# Altium schematic sheet Error_Generator.SchDoc
size A; SheetNumber: 2; SheetTotal: 6
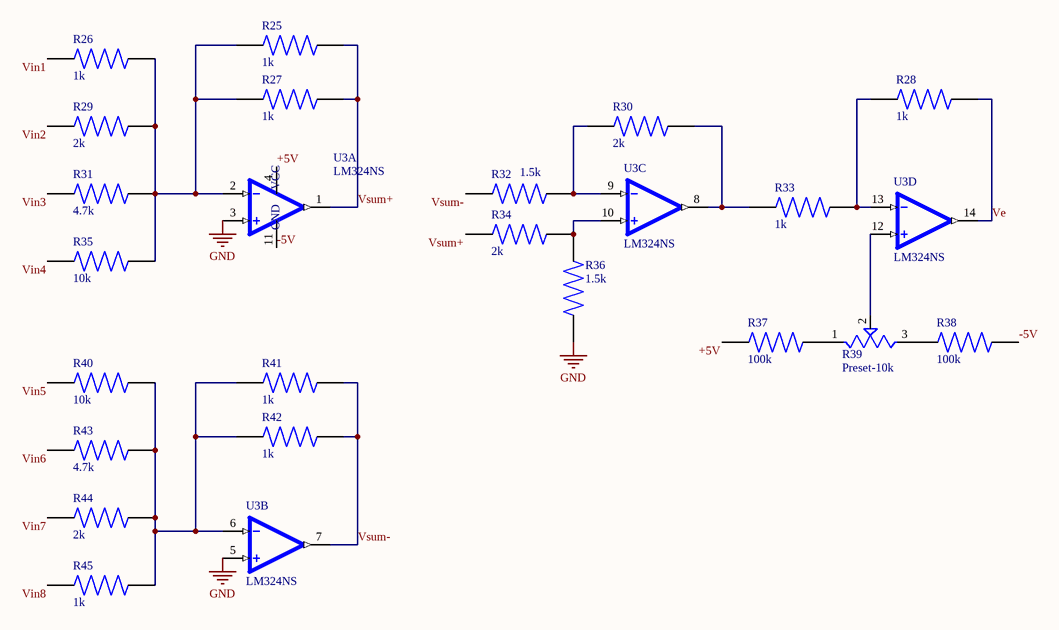
[diagram p0: Error_Generator.SchDoc]

## Parts
R25  1k  [RESC2012X60N]
R26  1k  [RESC2012X60N]
R27  1k  [RESC2012X60N]
R28  1k  [RESC2012X60N]
R29  2k  [RESC2012X60N]
R30  2k  [RESC2012X60N]
R31  4.7k  [RESC2012X60N]
R32  1.5k  [RESC2012X60N]
R33  1k  [RESC2012X60N]
R34  2k  [RESC2012X60N]
R35  10k  [RESC2012X60N]
R36  1.5k  [RESC2012X60N]
R37  100k  [RESC2012X60N]
R38  100k  [RESC2012X60N]
R39  Preset-10k  [TRIM_3306F-1-103]
R40  10k  [RESC2012X60N]
R41  1k  [RESC2012X60N]
R42  1k  [RESC2012X60N]
R43  4.7k  [RESC2012X60N]
R44  2k  [RESC2012X60N]
R45  1k  [RESC2012X60N]
U3  LM324NS  [SOIC127P780X200-14N]  (parts A,B,C,D of 4)

## Nets
GND: R36.1 U3.3(1IN+) U3.5(2IN+)
+5V: R37.1 U3.4(VCC)
-5V: R38.2 U3.11(GND)
Ve: R28.2 U3.14(4OUT)
Vin1: R26.1
Vin2: R29.1
Vin3: R31.1
Vin4: R35.1
Vin5: R40.1
Vin6: R43.1
Vin7: R44.1
Vin8: R45.1
Vsum+: R25.2 R27.2 R34.1 U3.1(1OUT)
Vsum-: R32.1 R41.2 R42.2 U3.7(2OUT)
NetR25_1: R25.1 R26.2 R27.1 R29.2 R31.2 R35.2 U3.2(1IN-)
NetR28_1: R28.1 R33.2 U3.13(4IN-)
NetR30_1: R30.1 R32.2 U3.9(3IN-)
NetR30_2: R30.2 R33.1 U3.8(3OUT)
NetR34_2: R34.2 R36.2 U3.10(3IN+)
NetR37_2: R37.2 R39.1(CCW)
NetR38_1: R38.1 R39.3(CW)
NetR39_2: R39.2(W) U3.12(4IN+)
NetR40_2: R40.2 R41.1 R42.1 R43.2 R44.2 R45.2 U3.6(2IN-)

## Library data of the parts
R25-R28 R33 R41 R42 R45 = 1k: 1 kOhms Â±1% 0.125W, 1/8W Chip Resistor 0805 (2012 Metric) Moisture Resistant Thick Film; RC0805FR-071KL; MF: Yageo; DigiKey_Part_Number: 311-1.00KCRTR-ND; Purchase-URL: https://pricing.snapeda.com/search?q=RC0805FR-071KL&ref=eda; Package: 2012 Yageo; Check_prices: https://www.snapeda.com/parts/RC0805FR-071KL/Yageo/view-part/?ref=eda; Value: *; SnapEDA_Link: https://www.snapeda.com/parts/RC0805FR-071KL/Yageo/view-part/?ref=snap; MP: RC0805FR-071KL
R29 R30 R34 R44 = 2k: 2 kOhms Â±1% 0.125W, 1/8W Chip Resistor 0805 (2012 Metric) Moisture Resistant Thick Film; RC0805FR-072KL; MF: Yageo; SnapEDA_Link: https://www.snapeda.com/parts/RC0805FR-072KL/Yageo/view-part/?ref=snap; Package: 2012 Yageo; Value: *; MP: RC0805FR-072KL; Check_prices: https://www.snapeda.com/parts/RC0805FR-072KL/Yageo/view-part/?ref=eda
R31 R43 = 4.7k: 4.7 kOhms Â±1% 0.125W, 1/8W Chip Resistor 0805 (2012 Metric) Moisture Resistant Thick Film; RC0805FR-074K7L; MF: Yageo; Check_prices: https://www.snapeda.com/parts/RC0805FR-074K7L/Yageo/view-part/?ref=eda; Value: *; Availability: In Stock; MP: RC0805FR-074K7L; Price: None; Package: 2012 Rohm Semiconductor; SnapEDA_Link: https://www.snapeda.com/parts/RC0805FR-074K7L/Yageo/view-part/?ref=snap; Purchase-URL: https://pricing.snapeda.com/search/part/RC0805FR-074K7L/?ref=eda
R32 R36 = 1.5k: Res Thin Film 0805 1.5K Ohm 0.1% 0.125W(1/8W) Â±25ppm/C Epoxy Pad SMD T/R; RT0805BRD071K5L; MF: Yageo; SnapEDA_Link: https://www.snapeda.com/parts/RT0805BRD071K5L/Yageo/view-part/?ref=snap; Package: 2012 Yageo; Value: *; MP: RT0805BRD071K5L; Check_prices: https://www.snapeda.com/parts/RT0805BRD071K5L/Yageo/view-part/?ref=eda
R35 R40 = 10k: 10 kOhms Â±1% 0.125W, 1/8W Chip Resistor 0805 (2012 Metric) Moisture Resistant Thick Film; RC0805FR-0710KL; MF: Yageo; Value: *; SnapEDA_Link: https://www.snapeda.com/parts/RC0805FR-0710KL/Yageo/view-part/?ref=snap; Purchase-URL: https://pricing.snapeda.com/search/part/RC0805FR-0710KL/?ref=eda; Availability: In Stock; Price: None; Package: 2012 Rohm Semiconductor; Check_prices: https://www.snapeda.com/parts/RC0805FR-0710KL/Yageo/view-part/?ref=eda; MP: RC0805FR-0710KL
R37 R38 = 100k: 100 kOhms Â±1% 0.125W, 1/8W Chip Resistor 0805 (2012 Metric) Moisture Resistant Thick Film; RC0805FR-07100KL; MF: Yageo; SnapEDA_Link: https://www.snapeda.com/parts/RC0805FR-07100KL/Yageo/view-part/?ref=snap; Package: 2012 Yageo; Value: *; MP: RC0805FR-07100KL; Check_prices: https://www.snapeda.com/parts/RC0805FR-07100KL/Yageo/view-part/?ref=eda
R39 = Preset: TRIMMER - 6MM ROUND, SINGLE-TURN,CERMET, 10K OHMS | Bourns 3306F-1-103; SnapEDA_Link: https://www.snapeda.com/parts/3306F-1-103/Bourns/view-part/?ref=snap; Package: 3306F Bourns; Value: *; MF: Bourns; MP: 3306F-1-103; Check_prices: https://www.snapeda.com/parts/3306F-1-103/Bourns/view-part/?ref=eda
U3 = LM324NS: 4-Channel industry standard operational amplifier 14-SO 0 to 70; LM324NSRG4; MF: Texas Instruments; Purchase-URL: https://pricing.snapeda.com/search/part/LM324NSRG4/?ref=eda; MP: LM324NSRG4; SnapEDA_Link: https://www.snapeda.com/parts/LM324NSRG4/Texas+Instruments/view-part/?ref=snap; Value: *; Package: SOP-14 Texas Instruments; Price: None; Availability: In Stock; Check_prices: https://www.snapeda.com/parts/LM324NSRG4/Texas+Instruments/view-part/?ref=eda